# EAGLE design breakout (EAGLE 6.5.0)
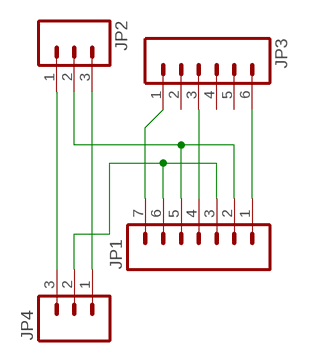
[diagram p0: schematic, sheet 1]

## Parts
JP1  M07  [1X07]
JP2  M03PTH  [1X03]
JP3  M06SIP  [1X06]
JP4  M03PTH  [1X03]

## Nets
N$1: JP1.1 JP3.6
N$2: JP1.4 JP3.3
N$3: JP1.3 JP1.6 JP4.2
N$4: JP2.3 JP4.1
N$5: JP2.1 JP4.3
N$6: JP1.2 JP1.5 JP2.2
N$7: JP1.7 JP3.1
Unconnected: JP3.2 JP3.4 JP3.5

## Library data of the parts
JP1 = SparkFun-Connectors:M07: Header 7 Standard 7-pin 0.1" header. Use with straight break away headers (SKU : PRT-00116), right angle break away headers (PRT-00553), swiss pins (PRT-00743), machine pins (PRT-00117), and female headers (PRT-00115). NOTES ON THE VARIANTS LOCK and LOCK_LONGPADS... This footprint was designed to help hold the alignment of a through-hole component (i.e. 7-pin header) while soldering it into place. You may notice that each hole has been shifted either up or down by 0.005 of an inch from it's more standard position (which is usually a perfectly straight line). This slight alteration caused the pins (the squares in the middle) to touch the edges of the holes. Because they are alternating, it causes a "brace" to hold the header in place. 0.005 has proven to be the perfect amount of "off-center" position when using our standard breakaway headers. Although looks a little odd when you look at the bare footprint, once you have a header in there, the alteration is very hard to notice. Also, if you push a header all the way into place, it is covered up entirely on the bottom side. This idea of altering the position of holes to aid alignment will be further integrated into the Sparkfun Library for other footprints. It can help hold any component with 3 or more connection pins.
JP2 JP4 = SparkFun:M03: Header 3 Standard 3-pin 0.1" header. Use with straight break away headers (SKU : PRT-00116), right angle break away headers (PRT-00553), swiss pins (PRT-00743), machine pins (PRT-00117), and female headers (PRT-00115). Molex polarized connector foot print use with SKU : PRT-08232 with associated crimp pins and housings.
JP3 = SparkFun:M06: Header 6 Standard 6-pin 0.1" header. Use with straight break away headers (SKU : PRT-00116), right angle break away headers (PRT-00553), swiss pins (PRT-00743), machine pins (PRT-00117), and female headers (PRT-00115). Molex polarized connector foot print use with SKU : PRT-08094 with associated crimp pins and housings. NOTES ON THE VARIANTS LOCK and LOCK_LONGPADS... This footprint was designed to help hold the alignment of a through-hole component (i.e. 6-pin header) while soldering it into place. You may notice that each hole has been shifted either up or down by 0.005 of an inch from it's more standard position (which is a perfectly straight line). This slight alteration caused the pins (the squares in the middle) to touch the edges of the holes. Because they are alternating, it causes a "brace" to hold the component in place. 0.005 has proven to be the perfect amount of "off-center" position when using our standard breakaway headers. Although looks a little odd when you look at the bare footprint, once you have a header in there, the alteration is very hard to notice. Also, if you push a header all the way into place, it is covered up entirely on the bottom side. This idea of altering the position of holes to aid alignment will be further integrated into the Sparkfun Library for other footprints. It can help hold any component with 3 or more connection pins.

## Board
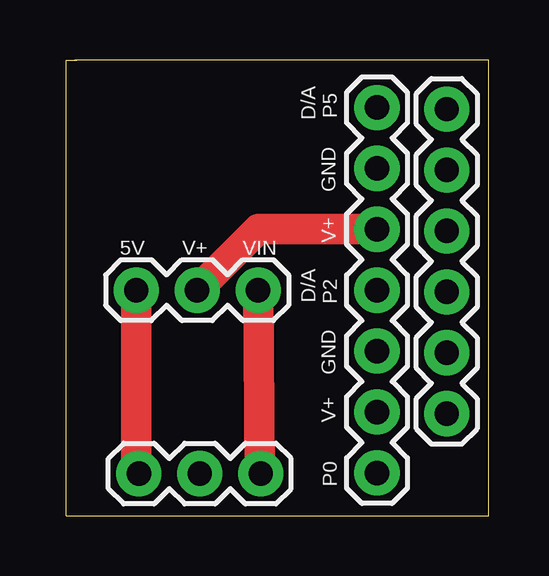
[diagram p1: board, top side]
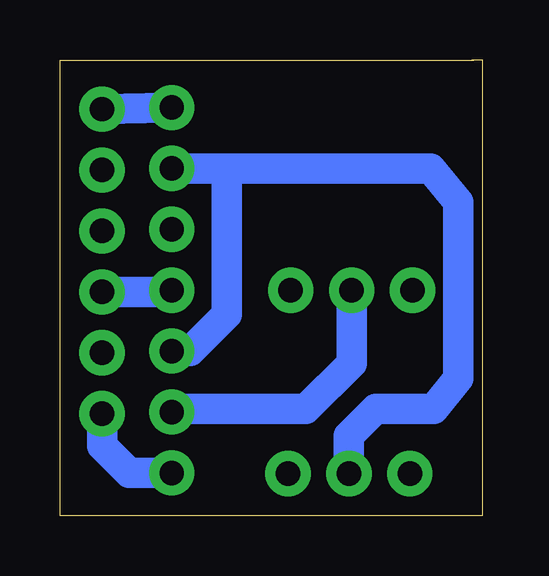
[diagram p2: board, bottom side, seen from below]

Size 17.61 x 19 mm. Coordinates in mm from the lower left corner, seen from the top.
Outline: 0.36,19 17.61,19 17.61,0 0,0 0,18.99 0.45,18.99
Copper layers (1*16): Top 0.0356mm / dielectric 1.5011mm / Bottom 0.0356mm
Design rules "default": minimum track width 8mil, minimum drill 13mil, track to track 12mil, track to pad 12mil, pad to pad 12mil, via to via 12mil, smd to smd 8mil, copper to edge 15mil, drill to drill 12mil, minimum pad ring 7mil, minimum via ring 7mil, stop-mask expansion 4mil, vias tented up to drill 25mil, thermal gap 10mil

### Footprints (pad centres in the part's own frame; a part is rotated, then mirrored left to right if it is on the bottom)
1X07 = drill 1.016 pad 1.88: 1 0,0; 2 2.54,0; 3 5.08,0; 4 7.62,0; 5 10.16,0; 6 12.7,0; 7 15.24,0
1X03 = drill 1.016 pad 1.88: 1 0,0; 2 2.54,0; 3 5.08,0
1X06 = drill 1.016 pad 1.88: 1 0,0; 2 2.54,0; 3 5.08,0; 4 7.62,0; 5 10.16,0; 6 12.7,0

### Placement (x,y rotation side)
JP1  12.95,17.02 270 top
JP2  8.11,1.75 180 top
JP3  15.86,4.25 90 top
JP4  2.92,9.4 0 top

### Tracks (layer width: path | path; a pad name or v marks a point on that pad's centre or on a via)
N$1
  Bottom 1.27: JP1.1 13.12,17.02 JP3.6
N$2
  Bottom 1.27: JP3.3 13.02,9.33 JP1.4
N$3
  Top 1.27: JP1.3 8,11.94 JP4.2
  Bottom 1.27: JP4.2 5.46,6.35 7.37,4.45 12.83,4.45 JP1.6
N$4
  Top 1.27: JP4.1 2.92,1.73 JP2.3
N$5
  Top 1.27: JP4.3 8.06,1.73 JP2.1
N$6
  Bottom 1.27: JP1.5 12.19,6.86 10.67,8.38 10.67,14.1 11.05,14.48 | JP2.2 5.57,3.32 4.45,4.45 2.03,4.45 1.02,5.71 1.02,13.08 2.16,14.48 11.05,14.48 | JP1.2 11.05,14.48
N$7
  Bottom 1.27: JP3.1 15.86,2.91 14.73,1.78 JP1.7

### Text on the board
tPlace: D/A | D/A
tNames: P5 | GND | V+ | V+ | 5V | VIN | P2 | GND | V+ | P0